# Altium schematic sheet SH3 - BATTERY MANAGER.SchDoc: Battery Manager
size Letter; DrawnBy: Ayesha Ebrahim; SheetNumber: 1; SheetTotal: 6
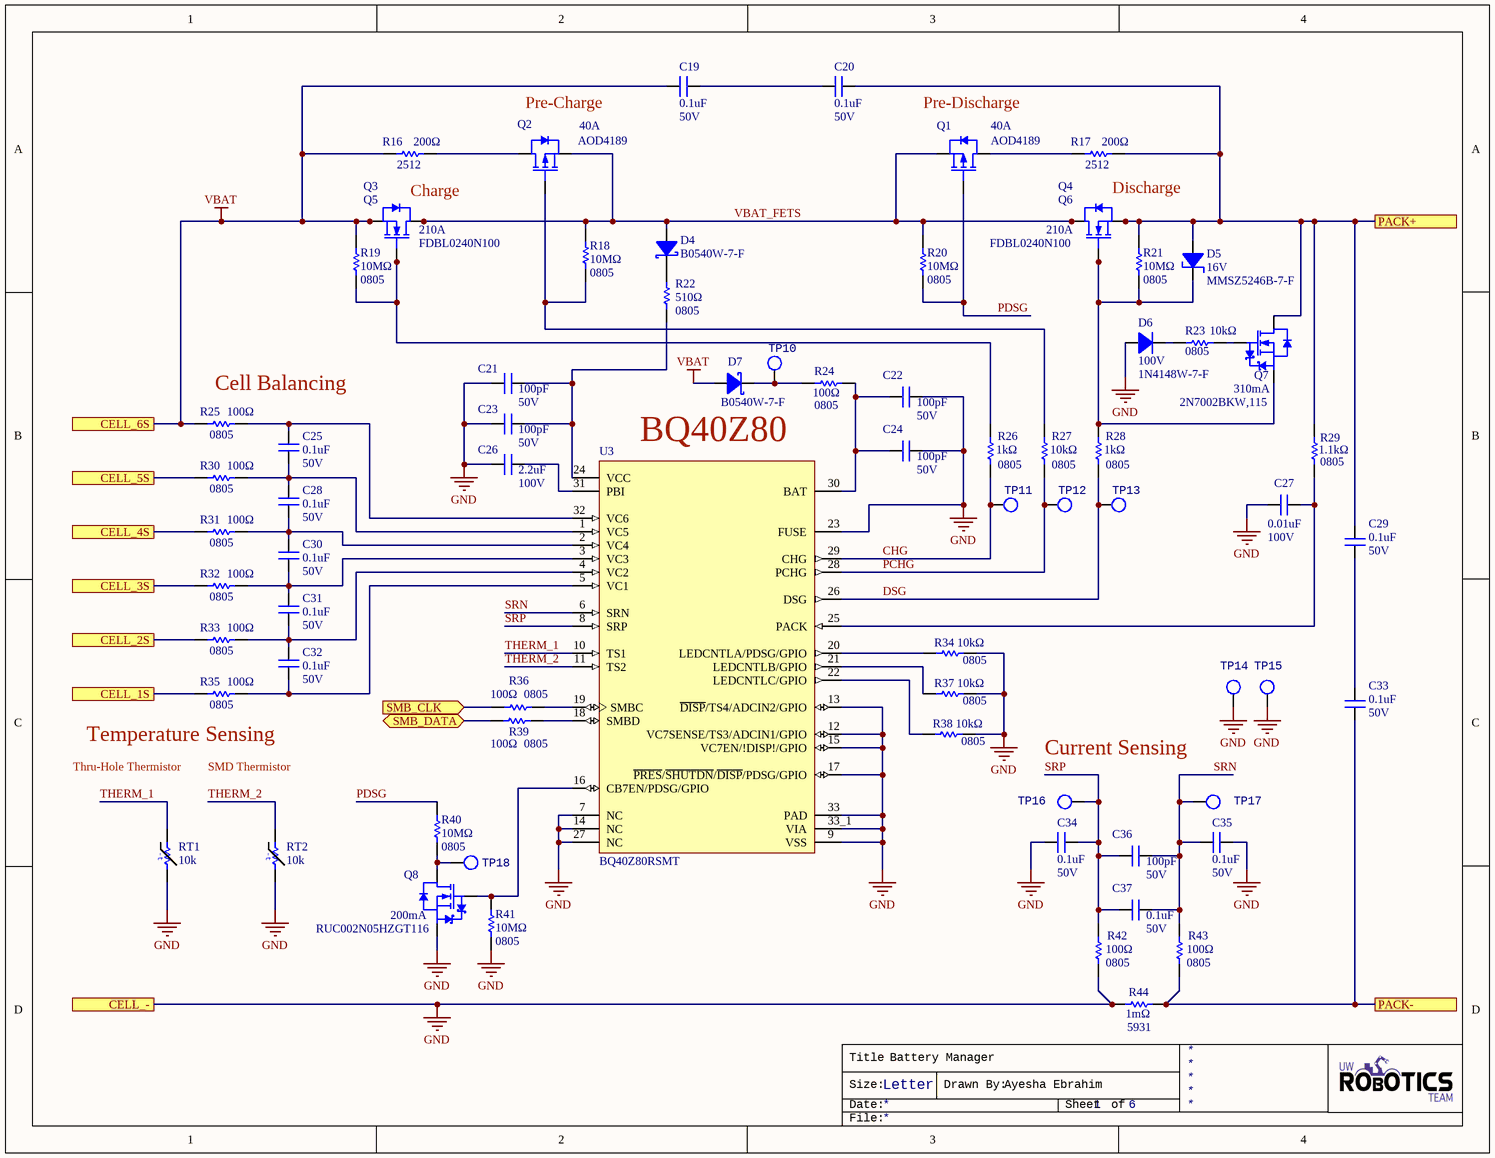
[diagram p0: SH3 - BATTERY MANAGER.SchDoc]

## Parts
C19  value 0.1uF  Voltage Rating: 50V  [CAPC2012X140N]  (hidden comment: CAP_0.1uF_50V_0805)
C20  value 0.1uF  Voltage Rating: 50V  [CAPC2012X140N]  (hidden comment: CAP_0.1uF_50V_0805)
C21  value 100pF  Voltage Rating: 50V  [CAPC2012X140N]  (hidden comment: CAP_100pF_50V_0805)
C22  value 100pF  Voltage Rating: 50V  [CAPC2012X140N]  (hidden comment: CAP_100pF_50V_0805)
C23  value 100pF  Voltage Rating: 50V  [CAPC2012X140N]  (hidden comment: CAP_100pF_50V_0805)
C24  value 100pF  Voltage Rating: 50V  [CAPC2012X140N]  (hidden comment: CAP_100pF_50V_0805)
C25  value 0.1uF  Voltage Rating: 50V  [CAPC2012X140N]  (hidden comment: CAP_0.1uF_50V_0805)
C26  value 2.2uF  Voltage Rating: 100V  [CAPC1210(3225)]  (hidden comment: CAP_2.2uF_100V_1210)
C27  value 0.01uF  Voltage Rating: 100V  [CAPC2012X140N]  (hidden comment: CAP_0.01uF_100V_0805)
C28  value 0.1uF  Voltage Rating: 50V  [CAPC2012X140N]  (hidden comment: CAP_0.1uF_50V_0805)
C29  value 0.1uF  Voltage Rating: 50V  [CAPC2012X140N]  (hidden comment: CAP_0.1uF_50V_0805)
C30  value 0.1uF  Voltage Rating: 50V  [CAPC2012X140N]  (hidden comment: CAP_0.1uF_50V_0805)
C31  value 0.1uF  Voltage Rating: 50V  [CAPC2012X140N]  (hidden comment: CAP_0.1uF_50V_0805)
C32  value 0.1uF  Voltage Rating: 50V  [CAPC2012X140N]  (hidden comment: CAP_0.1uF_50V_0805)
C33  value 0.1uF  Voltage Rating: 50V  [CAPC2012X140N]  (hidden comment: CAP_0.1uF_50V_0805)
C34  value 0.1uF  Voltage Rating: 50V  [CAPC2012X140N]  (hidden comment: CAP_0.1uF_50V_0805)
C35  value 0.1uF  Voltage Rating: 50V  [CAPC2012X140N]  (hidden comment: CAP_0.1uF_50V_0805)
C36  value 100pF  Voltage Rating: 50V  [CAPC2012X140N]  (hidden comment: CAP_100pF_50V_0805)
C37  value 0.1uF  Voltage Rating: 50V  [CAPC2012X140N]  (hidden comment: CAP_0.1uF_50V_0805)
D4  B0540W-7-F  [SOD-123_FLAT]
D5  Manufacturer Part Number 1: MMSZ5246B-7-F  Zener Voltage: 16V  [SOD-123_FLAT]  (hidden comment: DIO_ZENER_16V)
D6  value 100V  [SOD-123_FLAT]  (hidden comment: 1N4148W-7-F)
D7  B0540W-7-F  [SOD-123_FLAT]
Q1  Manufacturer Part Number 1: AOD4189  Id: 40A  [D-PAK]  (hidden comment: PMOS_40V_40A)
Q2  Manufacturer Part Number 1: AOD4189  Id: 40A  [D-PAK]  (hidden comment: PMOS_40V_40A)
Q3  Manufacturer Part Number 1: FDBL0240N100  Id: 210A  [8-HPSOF]  (hidden comment: NMOS_100V_210A)
Q4  Manufacturer Part Number 1: FDBL0240N100  Id: 210A  [8-HPSOF]  (hidden comment: NMOS_100V_210A)
Q5  NMOS_100V_210A  [8-HPSOF]  (value not drawn)
Q6  NMOS_100V_210A  [8-HPSOF]  (value not drawn)
Q7  Manufacturer Part Number 1: 2N7002BKW,115  Id: 310mA  [SOT323]  (hidden comment: NMOS_60V_310mA)
Q8  Manufacturer Part Number 1: RUC002N05HZGT116  Id: 200mA  [SOT23-3]  (hidden comment: NMOS_50V_200mA)
R16  value 200Ω  Package: 2512  [RESC6532X75N]  (hidden comment: RES_200Ω_2512)
R17  value 200Ω  Package: 2512  [RESC6532X75N]  (hidden comment: RES_200Ω_2512)
R18  value 10MΩ  Case Code (Imperial): 0805  [RESC2012X60N]  (hidden comment: RES_10MΩ_0805)
R19  value 10MΩ  Case Code (Imperial): 0805  [RESC2012X60N]  (hidden comment: RES_10MΩ_0805)
R20  value 10MΩ  Case Code (Imperial): 0805  [RESC2012X60N]  (hidden comment: RES_10MΩ_0805)
R21  value 10MΩ  Case Code (Imperial): 0805  [RESC2012X60N]  (hidden comment: RES_10MΩ_0805)
R22  value 510Ω  Case Code (Imperial): 0805  [RESC2012X60N]  (hidden comment: RES_510Ω_0805)
R23  value 10kΩ  Case Code (Imperial): 0805  [RESC2012X60N]  (hidden comment: RES_10kΩ_0805)
R24  value 100Ω  Case Code (Imperial): 0805  [RESC2012X60N]  (hidden comment: RES_100Ω_0805)
R25  value 100Ω  Case Code (Imperial): 0805  [RESC2012X60N]  (hidden comment: RES_100Ω_0805)
R26  value 1kΩ  Case Code (Imperial): 0805  [RESC2012X60N]  (hidden comment: RES_1kΩ_0805)
R27  value 10kΩ  Case Code (Imperial): 0805  [RESC2012X60N]  (hidden comment: RES_10kΩ_0805)
R28  value 1kΩ  Case Code (Imperial): 0805  [RESC2012X60N]  (hidden comment: RES_1kΩ_0805)
R29  value 1.1kΩ  Case Code (Imperial): 0805  [RESC2012X60N]  (hidden comment: RES_1.1kΩ_0805)
R30  value 100Ω  Case Code (Imperial): 0805  [RESC2012X60N]  (hidden comment: RES_100Ω_0805)
R31  value 100Ω  Case Code (Imperial): 0805  [RESC2012X60N]  (hidden comment: RES_100Ω_0805)
R32  value 100Ω  Case Code (Imperial): 0805  [RESC2012X60N]  (hidden comment: RES_100Ω_0805)
R33  value 100Ω  Case Code (Imperial): 0805  [RESC2012X60N]  (hidden comment: RES_100Ω_0805)
R34  value 10kΩ  Case Code (Imperial): 0805  [RESC2012X60N]  (hidden comment: RES_10kΩ_0805)
R35  value 100Ω  Case Code (Imperial): 0805  [RESC2012X60N]  (hidden comment: RES_100Ω_0805)
R36  value 100Ω  Case Code (Imperial): 0805  [RESC2012X60N]  (hidden comment: RES_100Ω_0805)
R37  value 10kΩ  Case Code (Imperial): 0805  [RESC2012X60N]  (hidden comment: RES_10kΩ_0805)
R38  value 10kΩ  Case Code (Imperial): 0805  [RESC2012X60N]  (hidden comment: RES_10kΩ_0805)
R39  value 100Ω  Case Code (Imperial): 0805  [RESC2012X60N]  (hidden comment: RES_100Ω_0805)
R40  value 10MΩ  Case Code (Imperial): 0805  [RESC2012X60N]  (hidden comment: RES_10MΩ_0805)
R41  value 10MΩ  Case Code (Imperial): 0805  [RESC2012X60N]  (hidden comment: RES_10MΩ_0805)
R42  value 100Ω  Case Code (Imperial): 0805  [RESC2012X60N]  (hidden comment: RES_100Ω_0805)
R43  value 100Ω  Case Code (Imperial): 0805  [RESC2012X60N]  (hidden comment: RES_100Ω_0805)
R44  value 1mΩ  Package: 5931  [RES-5931]  (hidden comment: RES_1mΩ_5931)
RT1  Resistance: 10k  [HDR1X2 - PTH Thermistor]  (hidden comment: THERM_10k_FREE_HANGING)
RT2  Resistance: 10k  [RESC0603(1608)_N]  (hidden comment: THERM_10k_0603)
TP10  TESTPOINT_LOOP  [TESTPOINT_LOOP]  (value not drawn)
TP11  TESTPOINT_LOOP  [TESTPOINT_LOOP]  (value not drawn)
TP12  TESTPOINT_LOOP  [TESTPOINT_LOOP]  (value not drawn)
TP13  TESTPOINT_LOOP  [TESTPOINT_LOOP]  (value not drawn)
TP14  TESTPOINT_LOOP  [TESTPOINT_LOOP]  (value not drawn)
TP15  TESTPOINT_LOOP  [TESTPOINT_LOOP]  (value not drawn)
TP16  TESTPOINT_LOOP  [TESTPOINT_LOOP]  (value not drawn)
TP17  TESTPOINT_LOOP  [TESTPOINT_LOOP]  (value not drawn)
TP18  TESTPOINT_LOOP  [TESTPOINT_LOOP]  (value not drawn)
U3  BQ40Z80RSMT  [BQ40Z80RSMT]

## Ports
CELL_1S, CELL_2S, CELL_3S, CELL_4S, CELL_5S, CELL_6S, CELL_-, PACK+, PACK-, SMB_CLK (in), SMB_DATA (bidir)

## Nets
GND: C21.1 C22.2 C23.1 C24.2 C26.1 C27.1 C34.1 C35.2 D6.2 Q8.2(S) R34.2 R37.2 R38.2 R41.1 R42.1 R44.1 RT1.2 RT2.2 TP14.1 TP15.1 U3.7(NC) U3.9(VSS) U3.12(VC7SENSE/TS3/ADCIN1/GPIO) U3.13(~{DISP}/TS4/ADCIN2/GPIO) U3.14(NC) U3.15(VC7EN/!DISP!/GPIO) U3.17(~{PRES}/~{SHUTDN}/~{DISP}/PDSG/GPIO) U3.23(FUSE) U3.27(NC) U3.33(PAD) U3.33_1(VIA) ; port CELL_-
VBAT: C19.1 D7.2 Q3.2(Source) Q5.2(Source) R16.1 R19.2 R25.1 ; port CELL_6S
CELL_1S: R35.1 ; port CELL_1S
CELL_2S: R33.1 ; port CELL_2S
CELL_3S: R32.1 ; port CELL_3S
CELL_4S: R31.1 ; port CELL_4S
CELL_5S: R30.1 ; port CELL_5S
CHG: R26.1 TP11.1 U3.29(CHG)
DSG: R28.1 TP13.1 U3.26(DSG)
PACK+: C20.2 C29.2 D5.1(Anode) Q4.2(Source) Q6.2(Source) Q7.3(D) R17.2 R21.2 R29.2 ; port PACK+
PACK-: C33.1 R43.1 R44.2 ; port PACK-
PCHG: R27.1 TP12.1 U3.28(PCHG)
PDSG: Q1.2(Gate) R20.1 R40.2
SMB_CLK: R36.1 ; port SMB_CLK
SMB_DATA: R39.1 ; port SMB_DATA
SRN: C35.1 C36.2 C37.2 R43.2 TP17.1 U3.6(SRN)
SRP: C34.2 C36.1 C37.1 R42.2 TP16.1 U3.8(SRP)
THERM_1: RT1.1 U3.10(TS1)
THERM_2: RT2.1 U3.11(TS2)
VBAT_FETS: D4.2 Q1.3(Source) Q2.3(Source) Q3.3(Drain) Q4.3(Drain) Q5.3(Drain) Q6.3(Drain) R18.2 R20.2
NetC19_2: C19.2 C20.1
NetC21_2: C21.2 C23.2 R22.1 U3.24(VCC)
NetC22_1: C22.1 C24.1 R24.2 U3.30(BAT)
NetC25_1: C25.1 C28.2 R30.2 U3.1(VC5)
NetC25_2: C25.2 R25.2 U3.32(VC6)
NetC26_2: C26.2 U3.31(PBI)
NetC27_2: C27.2 R29.1 U3.25(PACK)
NetC28_1: C28.1 C30.2 R31.2 U3.2(VC4)
NetC29_1: C29.1 C33.2
NetC30_1: C30.1 C31.2 R32.2 U3.3(VC3)
NetC31_1: C31.1 C32.2 R33.2 U3.4(VC2)
NetC32_1: C32.1 R35.2 U3.5(VC1)
NetD4_1: D4.1 R22.2
NetD5_2: D5.2(Cathode) Q4.1(Gate) Q6.1(Gate) Q7.2(S) R21.1 R28.2
NetD6_1: D6.1 R23.1
NetD7_1: D7.1 R24.1 TP10.1
NetQ1_1: Q1.1(Drain) R17.1
NetQ2_1: Q2.1(Drain) R16.2
NetQ2_2: Q2.2(Gate) R18.1 R27.2
NetQ3_1: Q3.1(Gate) Q5.1(Gate) R19.1 R26.2
NetQ7_1: Q7.1(G) R23.2
NetQ8_1: Q8.1(G) R41.2 U3.16(CB7EN/PDSG/GPIO)
NetQ8_3: Q8.3(D) R40.1 TP18.1
NetR34_1: R34.1 U3.20(LEDCNTLA/PDSG/GPIO)
NetR36_2: R36.2 U3.19(SMBC)
NetR37_1: R37.1 U3.21(LEDCNTLB/GPIO)
NetR38_1: R38.1 U3.22(LEDCNTLC/GPIO)
NetR39_2: R39.2 U3.18(SMBD)

## Notes on the sheet
- (near Q2) Pre-Charge
- (near Q1) Pre-Discharge
- Charge
- Discharge
- (near R25) Cell Balancing
- BQ40Z80
- Thru-Hole Thermistor
- (near R35) Temperature Sensing
- SMD Thermistor
- Current Sensing
- Title
- Size:
- Date:
- Letter
- Drawn By:
- Sheet
- of
- File:
- (in symbol THERM_10k_0603) -t
- (in symbol THERM_10k_FREE_HANGING) -t

## Library data of the parts
C19 C20 C25 C28-C35 C37 = CAP_0.1uF_50V_0805: CAP CER 0.1UF 50V X7R 0805; Manufacturer 1: Murata Electronics; Manufacturer Part Number 1: GCD21BR71H104KA01L; Capacitance: 100nF; Tolerance: 10%; Mount: Surface Mount; Case/Package: 0805; Case Code (Metric): 2012; Case Code (Imperial): 0805; Min Operating Temperature: -55°C; Max Operating Temperature: 125°C; Dielectric: X7R; Termination: SMD/SMT; Length: 2mm; Height: 1.25mm; Width: 0.049inch; Thickness: 0.049inch; Depth: 1.25mm; Ratings: AEC-Q200; ComponentLink1URL: https://datasheet.ciiva.com/29537/c03e-29537701.pdf?src-supplier=Digi-Key; ComponentLink1Description: https://datasheet.ciiva.com/29537/c03e-29537701.pdf?src-supplier=Digi-Key; Supplier 1: Digi-Key; Supplier Part Number 1: 490-11955-1-ND
C21-C24 C36 = CAP_100pF_50V_0805: CAP CER 100PF 50V C0G/NP0 0805; Manufacturer 1: KEMET; Manufacturer Part Number 1: C0805C101J5GACTU; Tolerance: 5%; Dielectric: C0G, NP0; Mount: Surface Mount; Case/Package: 0805; Case Code (Metric): 2012; Case Code (Imperial): 0805; Min Operating Temperature: -55°C; Max Operating Temperature: 125°C; Capacitance: 100pF; Termination: SMD/SMT; Supplier 1: Digi-Key; Supplier Part Number 1: 399-1122-1-ND
C26 = CAP_2.2uF_100V_1210: CAP CER 2.2UF 100V X7R 1210; Manufacturer 1: Taiyo Yuden; Manufacturer Part Number 1: HMK325B7225KMHP; Tolerance: 10%; Mount: Surface Mount; Case/Package: 1210 (3225 Metric); Case Code (Metric): 3225; Case Code (Imperial): 1210; Min Operating Temperature: -55°C; Max Operating Temperature: 125°C; Capacitance: 2.2uF; Dielectric: X7R; Termination: SMD/SMT; Supplier 1: Digi-Key; Supplier Part Number 1: 587-5396-1-ND
C27 = CAP_0.01uF_100V_0805: CAP CER 10000PF 100V X7R 0805; Manufacturer 1: KEMET; Manufacturer Part Number 1: C0805C103K1RACTU; Tolerance: 10%; Mount: Surface Mount; Case/Package: 0805; Case Code (Metric): 2012; Case Code (Imperial): 0805; Min Operating Temperature: -55°C; Max Operating Temperature: 125°C; Dielectric: X7R; Termination: SMD/SMT; Supplier 1: Digi-Key; Supplier Part Number 1: 399-1159-1-ND
D4 D7 = DIO_SCHOTTKY_40V_500mA: DIODE SCHOTTKY 40V 500MA SOD123; Manufacturer: Diodes Inc.; Manufacturer 1: Diodes Incorporated; Capacitance: 170pF; Max Junction Temp: +150°C; Value: 170pF; Peak Reverse Current: 20uA; Automotive Grade: Grade 0; Max Surge Forward Current: 5.5A; Standoff Height: 0mm; Forward Current: 0.5A; Digikey Description: DIODE SCHOTTKY 40V 500MA SOD123; ComponentLink2Description: Datasheet; Package: SOD123; Height: 1.45mm; Temperature Range High: +150°C; Mouser Description: Schottky Diodes & Rectifiers 40V 410mW; Category: Diode; Temperature: -65°C to +150°C; Reverse Voltage: 40V; Manufacturer Part Number: B0540W-7-F; Footprint Url: https://www.diodes.com/assets/Package-Files/SOD123.pdf; Octopart: https://octopart.com/b0540w-7-f-diodes+inc.-325656; Device Class L1: Discrete Semiconductors; Automotive: Yes; ComponentLink2URL: https://www.diodes.com/assets/Datasheets/ds30138.pdf; Lead Free: Yes; Temperature Range Low: -65°C; Device Class L3: Schottky Diodes; RoHS: TRUE; Max Repetitive Reverse Voltage: 40V; Device Class L2: Diodes; Supplier 1: Digi-Key; Supplier Part Number 1: B0540W-FDITR-ND; Manufacturer Part Number 1: B0540W-7-F
D5 = DIO_ZENER_16V: DIODE ZENER 16V 500MW SOD123; Manufacturer 1: Diodes Incorporated; Impedance: 17Ω; Max Reverse Leakage Current: 100nA; Tolerance: 5%; Forward Voltage: 900mV; Supplier 1: Digi-Key; Case/Package: SOD-123; Max Power Dissipation: 500mW; Supplier Part Number 1: MMSZ5246B-FDITR-ND
D6 = DIO_100V_300mA: DIODE GEN PURP 100V 300MA SOD123; Manufacturer 1: Diodes Incorporated; Device Class L2: Diodes; Supplier 1: Digi-Key; Supplier Part Number 1: 1N4148W-FDICT-ND; Manufacturer Part Number 1: 1N4148W-7-F
Q1 Q2 = PMOS_40V_40A: MOSFET P-CH 40V 40A TO252; Manufacturer 1: Alpha & Omega Semiconductor Inc.; FET Type: P-Channel; Vgs (Max): 20V; Power Dissipation (Max): 62.5W; Supplier 1: Digi-Key; Supplier Part Number 1: 785-1351-1-ND; Vdss: 40V; Supplier Device Package: D-PAK (TO-252)
Q3 Q4 = NMOS_100V_210A: MOSFET N-CH 100V 210A POWER56; Manufacturer 1: ON Semiconductor; FET Type: N-Channel; Vgs (Max): 20V; Power Dissipation (Max): 300W; Supplier 1: Digi-Key; Supplier Part Number 1: FDBL0240N100CT-ND; Vdss: 100V; Supplier Device Package: 8-HPSOF
Q5 Q6 = NMOS_100V_210A: MOSFET N-CH 100V 210A POWER56; Manufacturer Part Number 1: FDBL0240N100; Manufacturer 1: ON Semiconductor; FET Type: N-Channel; Vgs (Max): 20V; Power Dissipation (Max): 300W; Supplier 1: Digi-Key; Supplier Part Number 1: FDBL0240N100CT-ND; Vdss: 100V; Id: 210A; Supplier Device Package: 8-HPSOF
Q7 = NMOS_60V_310mA: NMOS N-CH 60V 310mA SOT-323; Manufacturer 1: Nexperia; Supplier 1: Digi-Key; Stock 1: 127361; Pricing 1: 1=0.36000, 10=0.29600, 25=0.24760, 100=0.12100, 250=0.11908, 500=0.10092, 1000=0.07013 (USD); RoHS: No; ComponentLink1URL: https://www.mouser.com/ds/2/302/2N7002BKW-1150600.pdf?src-supplier=Mouser; ComponentLink1Description: https://www.mouser.com/ds/2/302/2N7002BKW-1150600.pdf?src-supplier=Mouser; ComponentLink2URL: http://www.farnell.com/datasheets/1322445.pdf?src-supplier=Farnell; ComponentLink2Description: http://www.farnell.com/datasheets/1322445.pdf?src-supplier=Farnell; ComponentLink3URL: https://assets.nexperia.com/documents/data-sheet/2N7002BKW.pdf?src-supplier=Digi-Key; ComponentLink3Description: https://assets.nexperia.com/documents/data-sheet/2N7002BKW.pdf?src-supplier=Digi-Key; ComponentLink4URL: http://www.farnell.com/datasheets/1322445.pdf?src-supplier=Newark; ComponentLink4Description: http://www.farnell.com/datasheets/1322445.pdf?src-supplier=Newark; Supplier Part Number 1: 1727-4788-1-ND
Q8 = NMOS_50V_200mA: NMOS N-CH 50V 200mA 1.2V DRIVE SOT-23-3; Manufacturer 1: Rohm Semiconductor; Supplier 1: Digi-Key; Supplier Part Number 1: RUC002N05HZGT116CT-ND
R16 R17 = RES_200Ω_2512: RES 200 OHM 5% 1W 2512; Manufacturer 1: Stackpole Electronics Inc; Manufacturer Part Number 1: RMCF2512JT200R; Supplier 1: Digi-Key; Tolerance: 5%; Supplier Part Number 1: RMCF2512JT200RCT-ND; Dimensions: 0.250" L x 0.125" W (6.35mm x 3.18mm); Mount: Surface Mount
R18-R21 R40 R41 = RES_10MΩ_0805: RES SMD 10M OHM 5% 1/8W 0805; Manufacturer 1: Yageo; Manufacturer Part Number 1: RC0805JR-0710ML; Package: 0805 (2012 Metric); Tolerance: 5%; Supplier Part Number 1: 311-10MARCT-ND; Supplier 1: Digi-Key; Mount: Surface Mount; Case Code (Metric): 2012
R22 = RES_510Ω_0805: RES SMD 510 OHM 1% 1/8W 0805; Manufacturer 1: Yageo; Manufacturer Part Number 1: RC0805FR-07510RL; Resistance: 510R; Power Rating: 125mW; Supplier 1: Digi-Key; Case Code (Metric): 2012; Min Operating Temperature: -55°C; Max Operating Temperature: 155°C; Tolerance: 1%; Termination: SMD/SMT; Supplier Part Number 1: 311-510CRCT-ND
R23 R27 R34 R37 R38 = RES_10kΩ_0805: RES SMD 10K OHM 1% 1/8W 0805; Manufacturer 1: Yageo; Manufacturer Part Number 1: RC0805FR-0710KL; Power Rating: 125mW; Supplier 1: Digi-Key; Case Code (Metric): 2012; Min Operating Temperature: -55°C; Max Operating Temperature: 155°C; Resistance: 10K; Tolerance: 1%; Termination: SMD/SMT; Supplier Part Number 1: 311-10.0KCRCT-ND
R24 R25 R30-R33 R35 R36 R39 R42 R43 = RES_100Ω_0805: RES SMD 100 OHM 1% 1/8W 0805; Manufacturer 1: Yageo; Manufacturer Part Number 1: RC0805FR-07100RL; Power Rating: 125mW; Supplier 1: Digi-Key; Mount: Surface Mount; Case Code (Metric): 2012; Supplier Part Number 1: 311-100CRCT-ND
R26 R28 = RES_1kΩ_0805: RES SMD 1K OHM 1% 1/8W 0805; Manufacturer 1: Yageo; Manufacturer Part Number 1: RC0805FR-071KL; Power Rating: 125mW; Supplier 1: Digi-Key; Case Code (Metric): 2012; Min Operating Temperature: -55°C; Max Operating Temperature: 155°C; Resistance: 1K; Tolerance: 1%; Termination: SMD/SMT; Supplier Part Number 1: 311-1.00KCRCT-ND
R29 = RES_1.1kΩ_0805: RES SMD 1.1K OHM 1% 1/8W 0805; Manufacturer 1: Yageo; Manufacturer Part Number 1: RC0805FR-071K1L; Resistance: 1K1; Power Rating: 125mW; Supplier 1: Digi-Key; Case Code (Metric): 2012; Min Operating Temperature: -55°C; Max Operating Temperature: 155°C; Tolerance: 1%; Termination: SMD/SMT; Supplier Part Number 1: 311-1.10KCRCT-ND; Mount: Surface Mount
R44 = RES_1mΩ_5931: RES 0.001 OHM 1% 10W 5931; Manufacturer 1: Vishay Dale; Manufacturer Part Number 1: WSLP59311L000FEA; Dimensions: 0.591" L x 0.305" W (15.00mm x 7.75mm); Tolerance: 1%; Supplier Part Number 1: 541-10012-1-ND; Supplier 1: Digi-Key; Mount: Surface Mount
RT1 = THERM_10k_FREE_HANGING: THERMISTOR NTC 10KOHM 3380K BEAD; Manufacturer 1: Murata; Manufacturer Part Number 1: NXFT15XH103FA2B100; Power Rating: 7.5mW; Tolerance: 1%; Current Rating: 120uA; Max Power Dissipation: 100mW; Lead Diameter: 0.3mm; Supplier 1: Digi-Key; RoHS: Yes; Category: Interface ICs; Stock 1: 19053; Pricing 1: 1=0.91000, 5=0.86400, 10=0.75200, 25=0.66080, 50=0.54900, 100=0.46760, 500=0.40660, 1000=0.35578, 5000=0.31512 (USD); Mount: Free Hanging,Through Hole; Case/Package: Radial; Number of Pins: 2; Min Operating Temperature: -40°C; Max Operating Temperature: 125°C; Packaging: Bulk; Package Quantity: 1000; Termination: Wire; ComponentLink1URL: https://datasheet.ciiva.com/2849/r44e-2849356.pdf?src-supplier=Digi-Key; ComponentLink1Description: https://datasheet.ciiva.com/2849/r44e-2849356.pdf?src-supplier=Digi-Key; ComponentLink2URL: https://datasheet.ciiva.com/3282/r44e-3282445.pdf?src-supplier=Avnet; ComponentLink2Description: https://datasheet.ciiva.com/3282/r44e-3282445.pdf?src-supplier=Avnet; Supplier Part Number 1: 490-5630-ND
RT2 = THERM_10k_0603: THERMISTOR NTC 10K 1% OHM 0603; Manufacturer 1: TDK; Manufacturer Part Number 1: NTCG163JF103FT1; Supplier 1: Digi-Key; Stock 1: 94107; Pricing 1: 1=0.25000, 5=0.23600, 10=0.20900, 25=0.19240, 50=0.15400, 100=0.13200, 500=0.11550, 1000=0.09900 (USD); RoHS: Yes; Mount: Surface Mount; Case/Package: 0603; Number of Pins: 2; Case Code (Imperial): 0603; Case Code (Metric): 1608; Min Operating Temperature: -40°C; Max Operating Temperature: 125°C; Package Quantity: 4000; Tolerance: 1%; Packaging: Tape and Reel; Accuracy: 1%; Length: 1.6mm; Height: 0.8mm; Depth: 0.8mm; Radiation Hardening: No; Lead Free: Lead Free; ComponentLink1URL: https://datasheet.ciiva.com/11822/0900766b80feea16-11822415.pdf?src-supplier=RSComponents; ComponentLink1Description: https://datasheet.ciiva.com/11822/0900766b80feea16-11822415.pdf?src-supplier=RSComponents; ComponentLink2URL: https://datasheet.ciiva.com/2848/ntcg163jf103ft1-web-2848612.pdf?src-supplier=Digi-Key; ComponentLink2Description: https://datasheet.ciiva.com/2848/ntcg163jf103ft1-web-2848612.pdf?src-supplier=Digi-Key; ComponentLink3URL: https://datasheet.ciiva.com/2848/ntcg163jf103ft1-web-2848610.pdf?src-supplier=Digi-Key; ComponentLink3Description: https://datasheet.ciiva.com/2848/ntcg163jf103ft1-web-2848610.pdf?src-supplier=Digi-Key; ComponentLink4URL: https://datasheet.ciiva.com/2848/ntcg163jf103ft1-web-2848611.pdf?src-supplier=Digi-Key; ComponentLink4Description: https://datasheet.ciiva.com/2848/ntcg163jf103ft1-web-2848611.pdf?src-supplier=Digi-Key; Supplier Part Number 1: 445-2554-1-ND
TP10-TP18 = TESTPOINT_LOOP: Loop testpoint through-hole pad; Manufacturer Part Number 1: 5002; Manufacturer 1: Keystone Electronics; Supplier Part Number 1: 36-5002-ND; Supplier 1: Digi-Key; Mount: Through Hole
U3 = BATT_MANAGER: POWER MANAGEMENT IC: Battery Multi-Function Controller IC Lithium Ion/Polymer 32-VQFN (4x4); Manufacturer 1: Texas Instruments; SnapEDA_Link: https://www.snapeda.com/parts/BQ40Z80RSMT/Texas%20Instruments/view-part/2782044/?ref=snap; Manufacturer Part Number 1: BQ40Z80RSMT; Supplier Part Number 1: 296-BQ40Z80RSMTCT-ND; Supplier 1: Digi-Key